# EAGLE design ssslidar_v1.0_blade_SIG_bottom (EAGLE 7.6.0)
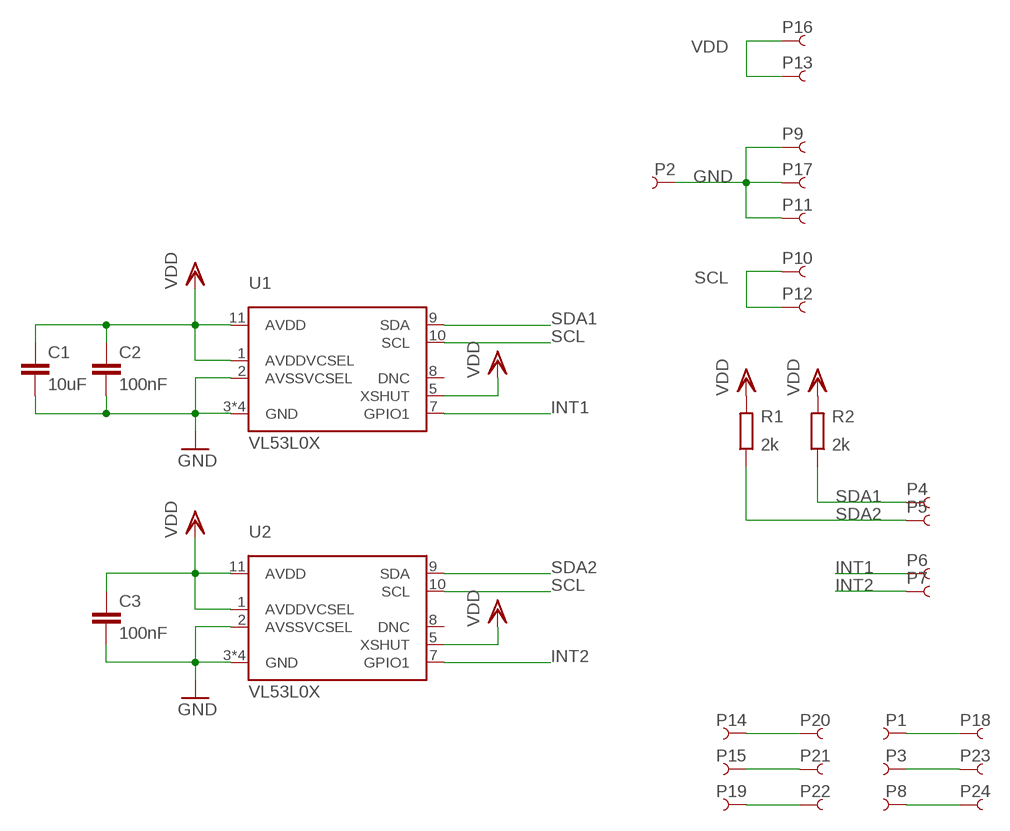
[diagram p0: schematic, sheet 1]

## Parts
C1  10uF  C0805  [0805_N]
C2  100nF  C0402  [0402_N]
C3  100nF  C0402  [0402_N]
P1  PIN_SMD_0.8X1_RECT  [PIN_SMD_0.8X1_RECT]
P2  PIN_SMD_1X2  [PIN_SMD_1X2]
P3  PIN_SMD_0.8X1_RECT  [PIN_SMD_0.8X1_RECT]
P4  PIN_SMD_0.8X1_RECT  [PIN_SMD_0.8X1_RECT]
P5  PIN_SMD_0.8X1_RECT  [PIN_SMD_0.8X1_RECT]
P6  PIN_SMD_0.8X1_RECT  [PIN_SMD_0.8X1_RECT]
P7  PIN_SMD_0.8X1_RECT  [PIN_SMD_0.8X1_RECT]
P8  PIN_SMD_0.8X1_RECT  [PIN_SMD_0.8X1_RECT]
P9  PIN_SMD_1X2  [PIN_SMD_1X2]
P10  PIN_SMD_1X2  [PIN_SMD_1X2]
P11  PIN_SMD_1X2  [PIN_SMD_1X2]
P12  PIN_SMD_1X2  [PIN_SMD_1X2]
P13  PIN_SMD_1X2  [PIN_SMD_1X2]
P14  PIN_SMD_0.8X1_RECT  [PIN_SMD_0.8X1_RECT]
P15  PIN_SMD_0.8X1_RECT  [PIN_SMD_0.8X1_RECT]
P16  PIN_SMD_1X2  [PIN_SMD_1X2]
P17  PIN_SMD_1X2  [PIN_SMD_1X2]
P18  PIN_SMD_0.8X1_RECT  [PIN_SMD_0.8X1_RECT]
P19  PIN_SMD_0.8X1_RECT  [PIN_SMD_0.8X1_RECT]
P20  PIN_SMD_0.8X1_RECT  [PIN_SMD_0.8X1_RECT]
P21  PIN_SMD_0.8X1_RECT  [PIN_SMD_0.8X1_RECT]
P22  PIN_SMD_0.8X1_RECT  [PIN_SMD_0.8X1_RECT]
P23  PIN_SMD_0.8X1_RECT  [PIN_SMD_0.8X1_RECT]
P24  PIN_SMD_0.8X1_RECT  [PIN_SMD_0.8X1_RECT]
R1  2k  R0402  [0402_N]
R2  2k  R0402  [0402_N]
U1  VL53L0X  [VL53L0X]
U2  VL53L0X  [VL53L0X]

## Nets
GND: C1.2 C2.2 C3.2 P2.P$1 P9.P$1 P11.P$1 P17.P$1 U1.2(AVSSVCSEL) U1.3(GND) U1.4(GND) U1.6(GND) U1.12(GND) U2.2(AVSSVCSEL) U2.3(GND) U2.4(GND) U2.6(GND) U2.12(GND)
INT1: P6.PIN U1.7(GPIO1)
INT2: P7.PIN U2.7(GPIO1)
N$1: P14.PIN P20.PIN
N$2: P15.PIN P21.PIN
N$3: P19.PIN P22.PIN
N$4: P1.PIN P18.PIN
N$5: P3.PIN P23.PIN
N$6: P8.PIN P24.PIN
SCL: P10.P$1 P12.P$1 U1.10(SCL) U2.10(SCL)
SDA1: P4.PIN R2.1 U1.9(SDA)
SDA2: P5.PIN R1.1 U2.9(SDA)
VDD: C1.1 C2.1 C3.1 P13.P$1 P16.P$1 R1.2 R2.2 U1.1(AVDDVCSEL) U1.5(XSHUT) U1.11(AVDD) U2.1(AVDDVCSEL) U2.5(XSHUT) U2.11(AVDD)
Unconnected: U1.8(DNC) U2.8(DNC)

## Library data of the parts
C1-C3 = Xevelabs:C: Non-polarized Capacitor
P1-P24 = Xevelabs:PIN
R1 R2 = Xevelabs:R: Resistor
U1 U2 = VL53L0X:VL53L0X: VL53L0X distance sensor

## Board
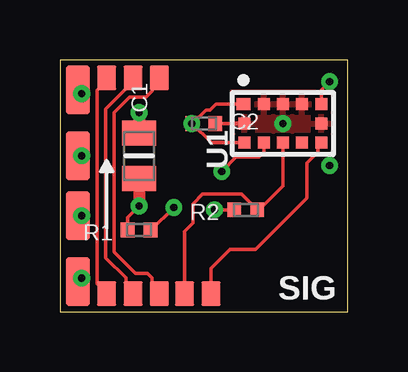
[diagram p1: board, top side]
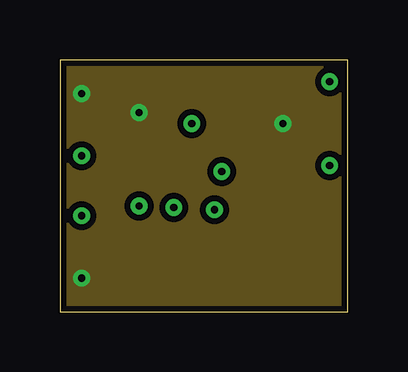
[diagram p2: board, inner layer Route2]
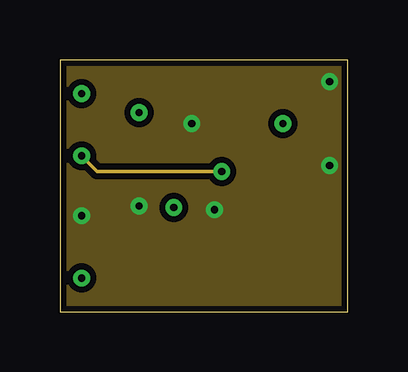
[diagram p3: board, inner layer Route3]
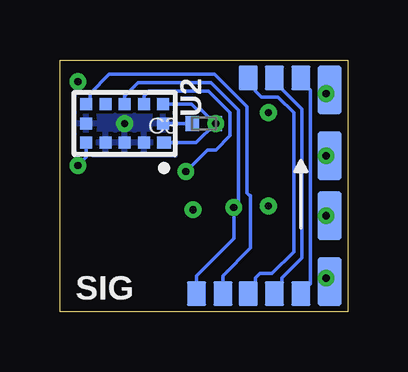
[diagram p4: board, bottom side, seen from below]

Size 12 x 10.5 mm. Coordinates in mm from the lower left corner, seen from the top.
Outline: 0,0 12,0 12,10.5 0,10.5 0,0
Copper layers (1*2*3*16): Top 0.035mm / dielectric 0.15mm / Route2 0.035mm / dielectric 1.1mm / Route3 0.035mm / dielectric 0.15mm / Bottom 0.035mm
Design rules "Xevelabs_6mil_4layers_eurocircuits": minimum track width 0.15mm, minimum drill 0.25mm, track to track 0.155mm, track to pad 0.155mm, pad to pad 0.155mm, via to via 0.155mm, smd to smd 0mil, copper to edge 0.25mm, drill to drill 0.25mm, minimum pad ring 0.15mm, minimum via ring 0.2mm, stop-mask expansion 0mil, vias tented up to drill 100mil, thermal gap 0.2mm

### Footprints (pad centres in the part's own frame; a part is rotated, then mirrored left to right if it is on the bottom)
0805_N = smd 1.05 x 1.4: 1 -0.95,0; 2 0.95,0
0402_N = smd 0.57 x 0.62: 1 -0.48,0; 2 0.48,0
PIN_SMD_0.8X1_RECT = smd 1 x 0.8: PIN 0,0
PIN_SMD_1X2 = smd 2 x 1: P$1 0,0
VL53L0X = smd 0.5 x 0.58: 1 0.8,1.64 | smd 0.5 x 0.5: 2 0.8,0.8; 3 0.8,0; 4 0.8,-0.8; 5 0.8,-1.6; 6 0,-1.6; 7 -0.8,-1.6; 8 -0.8,-0.8; 9 -0.8,0; 10 -0.8,0.8; 11 -0.8,1.6; 12 0,1.6

### Placement (x,y rotation side)
C1  3.3,6.5 90 top
C2  6,7.85 0 top
C3  6,7.85 180 bottom
P1  4.15,9.75 270 bottom
P2  0.75,9.25 270 bottom
P3  1.95,9.75 270 bottom
P4  5.2,0.75 90 top
P5  6.3,0.75 90 bottom
P6  6.3,0.75 90 top
P7  5.2,0.75 90 bottom
P8  3.05,0.75 270 bottom
P9  0.75,9.25 90 top
P10  0.75,6.5 90 bottom
P11  0.75,1.25 90 top
P12  0.75,6.5 90 top
P13  0.75,4 270 bottom
P14  1.95,9.75 90 top
P15  3.05,0.75 90 top
P16  0.75,4 270 top
P17  0.75,1.25 270 bottom
P18  4.15,0.75 270 bottom
P19  4.15,0.75 90 top
P20  1.95,0.75 90 top
P21  3.05,9.75 90 top
P22  4.15,9.75 90 top
P23  1.95,0.75 270 bottom
P24  3.05,9.75 270 bottom
R1  3.3,3.4 180 top
R2  7.75,4.25 180 top
U1  9.3,7.85 90 top
U2  9.3,7.85 270 bottom

### Tracks (layer width: path | path; a pad name or v marks a point on that pad's centre or on a via)
GND  (via drill 0.3)
  Top 0.15: v0.9,1.4 P11.P$1 | v0.9,9.1 P9.P$1 | C3.2 U2.12
  Top 0.5: v3.3,8.3 C1.2
  Bottom 0.15: v0.9,1.4 P11.P$1 | P9.P$1 v0.9,9.1 | U2.12 C3.2
  other vias: 9.3,7.85
  pour Route2 (isolate 0.254): 0.05,10.45 11.95,10.45 11.95,0.05 0.05,0.05
  pour Bottom: 7.15,9.2 11.45,9.2 11.45,6.5 7.15,6.5
  pour Top: 7.15,9.2 11.45,9.2 11.45,6.5 7.15,6.5
INT1
  Top 0.15: U1.7 10.9,6.95 10.75,6.8 10.75,6.65 10.3,6.2 10.3,4.75 8.15,2.6 7.1,2.6 6.3,1.8 P6.PIN
INT2
  Bottom 0.15: U2.7 10.75,8.8 10.75,9.1 9.95,9.9 5.55,9.9 4.2,8.55 4.2,4.95 4.05,4.8 | 4.05,4.85 4.05,4.8 | 4.05,4.8 4.05,2.65 5.2,1.5 P7.PIN
N$1
  Top 0.15: P20.PIN 1.55,1.15 1.55,9.25 1.95,9.65 P14.PIN
N$2
  Top 0.15: P15.PIN 2.75,1.05 2.75,1.4 1.9,2.25 1.9,8.45 3.05,9.6 P21.PIN
N$3
  Top 0.15: P19.PIN 3.85,1.05 3.85,1.4 3.65,1.6 3.15,1.6 2.25,2.5 2.25,8.3 2.9,8.95 3.6,8.95 3.85,9.2 3.85,9.35 4.15,9.65 P22.PIN
N$4
  Bottom 0.15: P1.PIN 3.85,9.45 3.85,9.2 3.6,8.95 2.9,8.95 2.25,8.3 2.25,2.5 3.15,1.6 3.65,1.6 3.85,1.4 3.85,1.05 P18.PIN
N$5
  Bottom 0.15: P23.PIN 1.55,1.15 1.55,9.25 1.95,9.65 P3.PIN
N$6
  Bottom 0.15: P8.PIN 2.75,1.05 2.75,1.4 1.9,2.25 1.9,8.45 3.05,9.6 P24.PIN
SCL  (via drill 0.3)
  Top 0.15: P12.P$1 v0.9,6.5 | U1.10 8.5,6.65 8.3,6.45 7.35,6.45 v6.75,5.85
  Route3 0.15: v6.75,5.85 1.55,5.85 v0.9,6.5
  Bottom 0.15: v0.9,6.5 P12.P$1 | U2.10 8.5,9 8.3,9.2 5.8,9.2 4.9,8.3 4.9,7.35 5.5,6.75 5.85,6.75 v6.75,5.85
SDA1
  Top 0.15: U1.9 9.3,5.25 8.3,4.25 R2.1 7.58,4.9 5.95,4.9 5.55,4.5 5.55,3.7 5.2,3.35 P4.PIN
SDA2  (via drill 0.3)
  Top 0.15: R1.1 3.8,3.4 v4.75,4.35
  Bottom 0.15: U2.9 9.3,9 8.75,9.55 5.7,9.55 4.55,8.4 4.55,4.55 v4.75,4.35 4.75,3.05 6.3,1.5 P5.PIN 6.3,0.9
VDD  (via drill 0.3)
  Top 0.15: v0.9,4 P13.P$1 | U1.5 10.9,9.25 v11.25,9.6 | U1.11 6.32,7.05 C3.1 v5.5,7.85 5.55,7.85 6.1,8.4 6.27,8.4 6.52,8.65 U1.1 U2.11 | R1.2 2.82,3.92 v3.3,4.4 | v6.45,4.25 R2.2
  Top 0.5: C1.1 v3.3,4.4
  Bottom 0.15: v0.9,4 P13.P$1 | U2.5 10.9,6.45 v11.25,6.1 | U2.11 6.52,8.65 6.27,8.4 6.1,8.4 5.55,7.85 C3.1 | U2.1 6.32,7.05 C3.1 | v5.5,7.85 C3.1
  pour Route3 (isolate 0.254): 0.05,10.45 11.95,10.45 11.95,0.05 0.05,0.05

### Text on the board
tPlace: SIG
bPlace: SIG